# Altium schematic sheet 50Pin_Connector.SchDoc
size A; DocumentNumber: 1; SheetNumber: 1; SheetTotal: 5
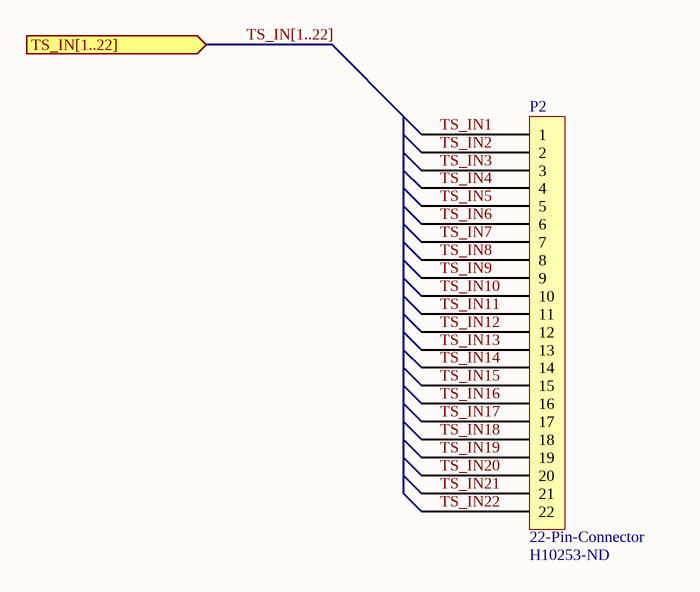
[diagram p0: 50Pin_Connector.SchDoc]

## Parts
P2  22-Pin-Connector  Supplier Part Number 1: H10253-ND  [22-Pin Conenctor]

## Ports
TS_IN[1..22]

## Nets
TS_IN1: P2.1
TS_IN2: P2.2
TS_IN3: P2.3
TS_IN4: P2.4
TS_IN5: P2.5
TS_IN6: P2.6
TS_IN7: P2.7
TS_IN8: P2.8
TS_IN9: P2.9
TS_IN10: P2.10
TS_IN11: P2.11
TS_IN12: P2.12
TS_IN13: P2.13
TS_IN14: P2.14
TS_IN15: P2.15
TS_IN16: P2.16
TS_IN17: P2.17
TS_IN18: P2.18
TS_IN19: P2.19
TS_IN20: P2.20
TS_IN21: P2.21
TS_IN22: P2.22

## Buses and harness runs
bus TS_IN[1..22] = port TS_IN[1..22]

## Library data of the parts
P2 = 22-Pin-Connector: Manufacturer: Hirose; Manufacturer Part Number: DF11-22DP-2DS(24); Number of Contacts: 22; Gender: Male; Connector Type: Male Pin; Contact Resistance: 30mR; Max Current Rating: 2A; Voltage Rating: 250V; Pitch: 2mm; Row Spacing: 0.079inch; Supplier 1: Digi-Key; Stock 1: 536; Pricing 1: 1=1.19, 20=1.0455, 100=0.902, 500=0.738, 1000=0.656 (USD); Mount: Through Hole; Contact Plating: Tin; Contact Material: Brass,Copper Alloy,Tin; Color: Black; Housing Color: Black; Housing Material: Polyamide; Min Operating Temperature: -30°C; Max Operating Temperature: 85°C; Number of Rows: 2; Termination: Solder; Packaging: Rail/Tube; Package Quantity: 20; Fastening Type: Detent; Number of Positions: 22; Current Rating: 2A; Orientation: Right Angle; Length: 24mm; Height: 5mm; Contact Mating Length: 0.118inch; Depth: 10mm; Radiation Hardening: No; Lead Free: Lead Free; ComponentLink1URL: http://docs-usa.electrocomponents.com/techlib:/itc_doclist_US.htm?stockno=6888963&src-supplier=Allied+Electronics; ComponentLink1Description: http://docs-usa.electrocomponents.com/techlib:/itc_doclist_US.htm?stockno=6888963&src-supplier=Allied+Electronics; ComponentLink2URL: https://www.verical.com/server-webapp/html/getDatasheet?partID=456315&src-supplier=Verical; ComponentLink2Description: https://www.verical.com/server-webapp/html/getDatasheet?partID=456315&src-supplier=Verical; ComponentLink3URL: http://www.hirose.co.jp/cataloge_hp/en_DF11_20130411.pdf?src-supplier=Future+Electronics; ComponentLink3Description: http://www.hirose.co.jp/cataloge_hp/en_DF11_20130411.pdf?src-supplier=Future+Electronics; ComponentLink4URL: http://www.farnell.com/datasheets/91550.pdf?src-supplier=Element14; ComponentLink4Description: http://www.farnell.com/datasheets/91550.pdf?src-supplier=Element14; ComponentLink5URL: http://www.mouser.com/ds/2/185/DF11_catalog-1064296.pdf?src-supplier=Mouser; ComponentLink5Description: http://www.mouser.com/ds/2/185/DF11_catalog-1064296.pdf?src-supplier=Mouser; ComponentLink6URL: http://documents.rs-components.com/techlib://itc_doclist_GB.htm?stockno=6056598&src-supplier=RSComponents; ComponentLink6Description: http://documents.rs-components.com/techlib://itc_doclist_GB.htm?stockno=6056598&src-supplier=RSComponents